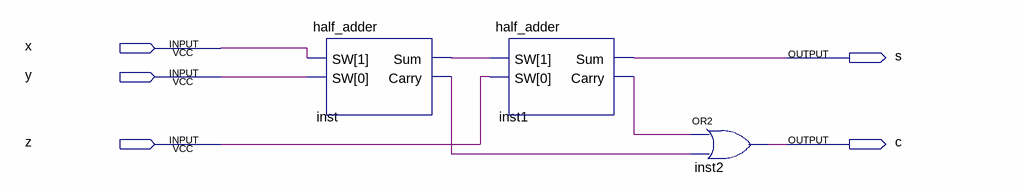
[diagram p0: schematic sheet]
// Quartus schematic full_adder.bdf as structural Verilog: 3 symbols, 5 pins
module full_adder (
  input  x,
  input  y,
  input  z,
  output s,
  output c
);

  wire inst1_carry, inst_carry, inst_sum;

  half_adder inst (.SW({x, y}), .Sum(inst_sum), .Carry(inst_carry));
  half_adder inst1 (.SW({inst_sum, z}), .Sum(s), .Carry(inst1_carry));
  or inst2 (c, inst1_carry, inst_carry);
endmodule
